# EAGLE design pwrboard (EAGLE 9.1.0)
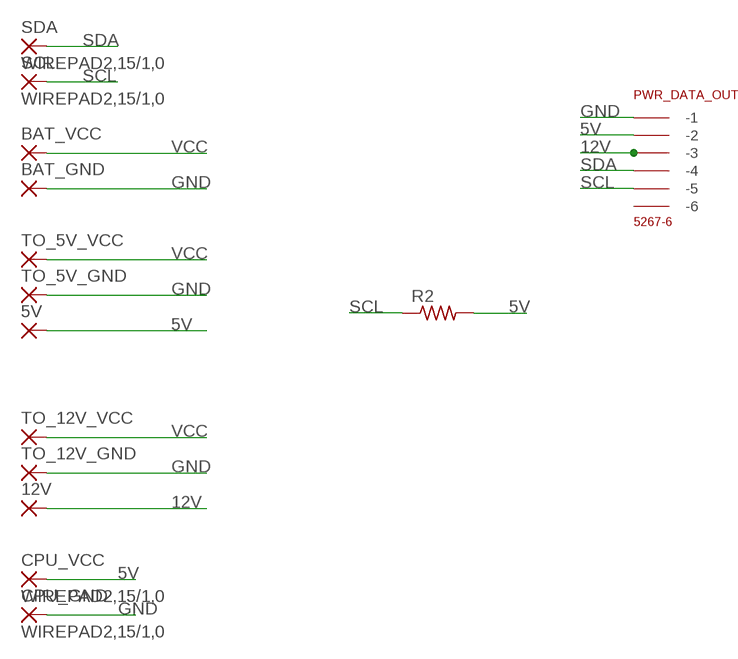
[diagram p0: schematic, sheet 1]

## Parts
5V  SMD5  [SMD2,54-5,08]
12V  SMD5  [SMD2,54-5,08]
BAT_GND  SMD5  [SMD2,54-5,08]
BAT_VCC  SMD5  [SMD2,54-5,08]
CPU_GND  WIREPAD2,15/1,0  [2,15/1,0]
CPU_VCC  WIREPAD2,15/1,0  [2,15/1,0]
PWR_DATA_OUT  5267-6  [5267-6]
R2  R-US_R1210  [R1210]
SCL  WIREPAD2,15/1,0  [2,15/1,0]
SDA  WIREPAD2,15/1,0  [2,15/1,0]
TO_5V_GND  SMD5  [SMD2,54-5,08]
TO_5V_VCC  SMD5  [SMD2,54-5,08]
TO_12V_GND  SMD5  [SMD2,54-5,08]
TO_12V_VCC  SMD5  [SMD2,54-5,08]

## Nets
5V [pwr]: 5V.1(P) CPU_VCC.1(P) PWR_DATA_OUT.P$2(-2) R2.2
12V [pwr]: 12V.1(P) PWR_DATA_OUT.P$3(-3)
GND [pwr]: BAT_GND.1(P) CPU_GND.1(P) PWR_DATA_OUT.P$1(-1) TO_5V_GND.1(P) TO_12V_GND.1(P)
N$6: PWR_DATA_OUT.P$6(-6)
SCL: PWR_DATA_OUT.P$5(-5) R2.1 SCL.1(P)
SDA: PWR_DATA_OUT.P$4(-4) SDA.1(P)
VCC [pwr]: BAT_VCC.1(P) TO_5V_VCC.1(P) TO_12V_VCC.1(P)

## Library data of the parts
5V 12V BAT_GND BAT_VCC TO_5V_GND TO_5V_VCC TO_12V_GND TO_12V_VCC = wirepad:SMD5: SMD PAD
CPU_GND CPU_VCC SCL SDA = wirepad:WIREPAD: Wire PAD connect wire on PCB
PWR_DATA_OUT = con-molex-spox:5267-6
R2 = resistor:R-US_: RESISTOR, American symbol

## Net classes
0 default: width 0.2 mm, clearance 0.1 mm
1 pwr: width 0.5 mm, clearance 0.2 mm

## Board
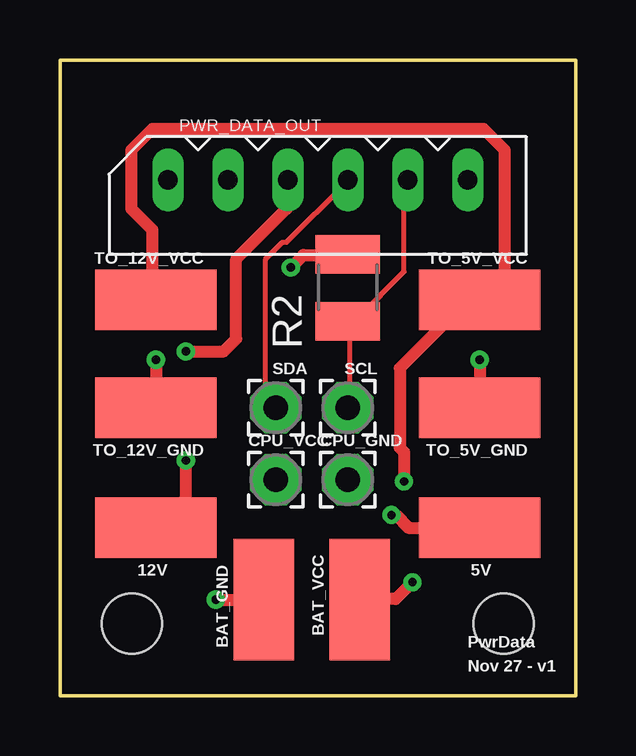
[diagram p1: board, top side]
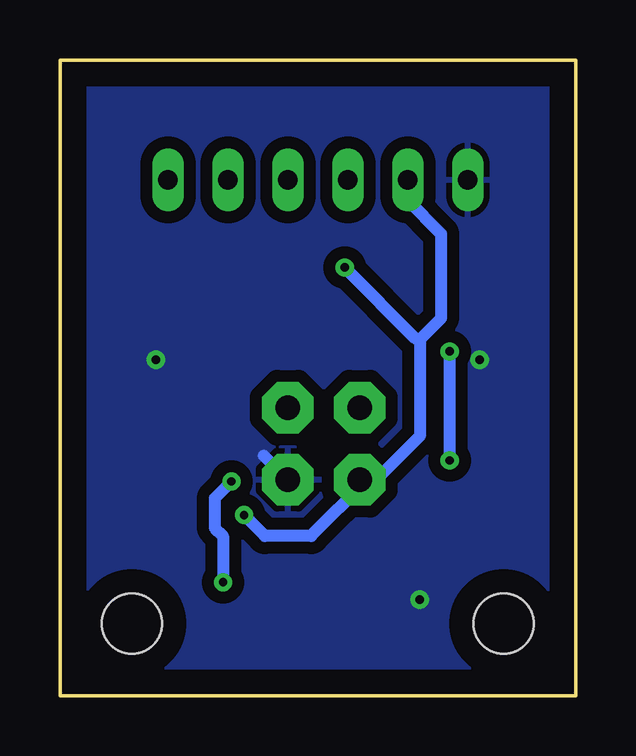
[diagram p2: board, bottom side, seen from below]

Size 21.5 x 26.5 mm. Coordinates in mm from the lower left corner, seen from the top.
Outline: 0,0 0,26.5 21.5,26.5 21.5,0 0,0
Copper layers (1*16): Top 0.035mm / dielectric 1.5mm / Bottom 0.035mm
Design rules "default *": minimum track width 6mil, minimum drill 0.35mm, track to track 0.5mm, track to pad 0.5mm, pad to pad 0.5mm, via to via 0.5mm, smd to smd 6mil, copper to edge 40mil, drill to drill 6mil, minimum pad ring 10mil, minimum via ring 8mil, stop-mask expansion 4mil, vias tented up to drill 0mil, thermal gap 10mil
Holes 2.5 mm at 3,3 18.5,3

### Footprints (pad centres in the part's own frame; a part is rotated, then mirrored left to right if it is on the bottom)
SMD2,54-5,08 = smd 2.54 x 5.08: 1 0,0
2,15/1,0 = drill 1.016 pad 2.159 octagon: 1 0,0
5267-6 = drill 0.8 long: P$1 0,0; P$2 2.5,0; P$3 5,0; P$4 7.5,0; P$5 10,0; P$6 12.5,0
R1210 = smd 1.6 x 2.7: 1 -1.4,0; 2 1.4,0

### Placement (x,y rotation side)
5V  17.5,7 90 top
12V  4,7 90 top
BAT_GND  8.5,4 0 top
BAT_VCC  12.5,4 0 top
CPU_GND  12,9 0 top
CPU_VCC  9,9 0 top
PWR_DATA_OUT  4.5,21.5 0 top
R2  12,17 90 top
SCL  12,12 0 top
SDA  9,12 0 top
TO_5V_GND  17.5,12 90 top
TO_5V_VCC  17.5,16.5 90 top
TO_12V_GND  4,12 90 top
TO_12V_VCC  4,16.5 90 top

### Tracks (layer width: path | path; a pad name or v marks a point on that pad's centre or on a via)
5V  (via drill 0.35)
  Top 0.5: v9.62,17.85 10.15,18.38 11.9,18.38 R2.2 | 5V.1 14.53,7 14,7.53 v13.82,7.53
  Bottom 0.5: 6.47,14.88 5.6,15.75 5.6,19.25 7,20.65 7,21.35 PWR_DATA_OUT.P$2 | 6.47,14.88 6.47,10.85 8.22,9.1 8.93,9.1 CPU_VCC.1 8.75,8.93 11.03,6.65 12.95,6.65 v13.82,7.53 | v9.62,17.85 6.65,14.88 6.47,14.88
12V  (via drill 0.35)
  Top 0.5: v5.25,14.35 6.83,14.35 7.35,14.88 7.35,18.2 9.45,20.3 9.45,21.35 PWR_DATA_OUT.P$3 | v5.25,9.8 5.25,8.22 4.03,7 12V.1
  Bottom 0.5: v5.25,9.8 v5.25,14.35
GND  (via drill 0.35)
  Top 0.5: v4,14 TO_12V_GND.1 | v6.5,4 BAT_GND.1 | v17.5,14 17.5,12.5 17.5,12.43 17.5,12.07 TO_5V_GND.1
  Bottom 0.5: CPU_GND.1 13,10
  pour Bottom (isolate 0.406): -3.5,27 -3.5,-1 -1,-3.5 23,-3.5 26.5,0 26.5,24.5 23.5,27.5 -3,27.5
SCL
  Top 0.2: PWR_DATA_OUT.P$5 14.35,21.35 14.35,17.68 12.43,15.75 12.07,15.75 R2.1 12.07,15.57 12.07,12.07 SCL.1
SDA
  Top 0.2: PWR_DATA_OUT.P$4 11.9,21.35 9.45,18.9 9.28,18.9 8.57,18.2 8.57,12.43 8.93,12.07 SDA.1
VCC  (via drill 0.35)
  Top 0.5: v14.7,4.72 14,4.03 12.6,4.03 BAT_VCC.1 | v14.35,8.93 14.35,10.15 14.18,10.32 14.18,13.65 16.98,16.45 17.5,16.45 TO_5V_VCC.1 17.68,16.62 18.55,17.5 18.55,22.75 17.68,23.62 3.85,23.62 2.98,22.75 2.98,20.3 3.85,19.43 3.85,16.62 TO_12V_VCC.1
  Bottom 0.5: v14.7,4.72 14.7,6.65 15.05,7 15.05,8.22 v14.35,8.93

### Text on the board
tNames: PwrData | Nov 27 - v1